# EAGLE design picoAvaR3 (EAGLE 6.1)
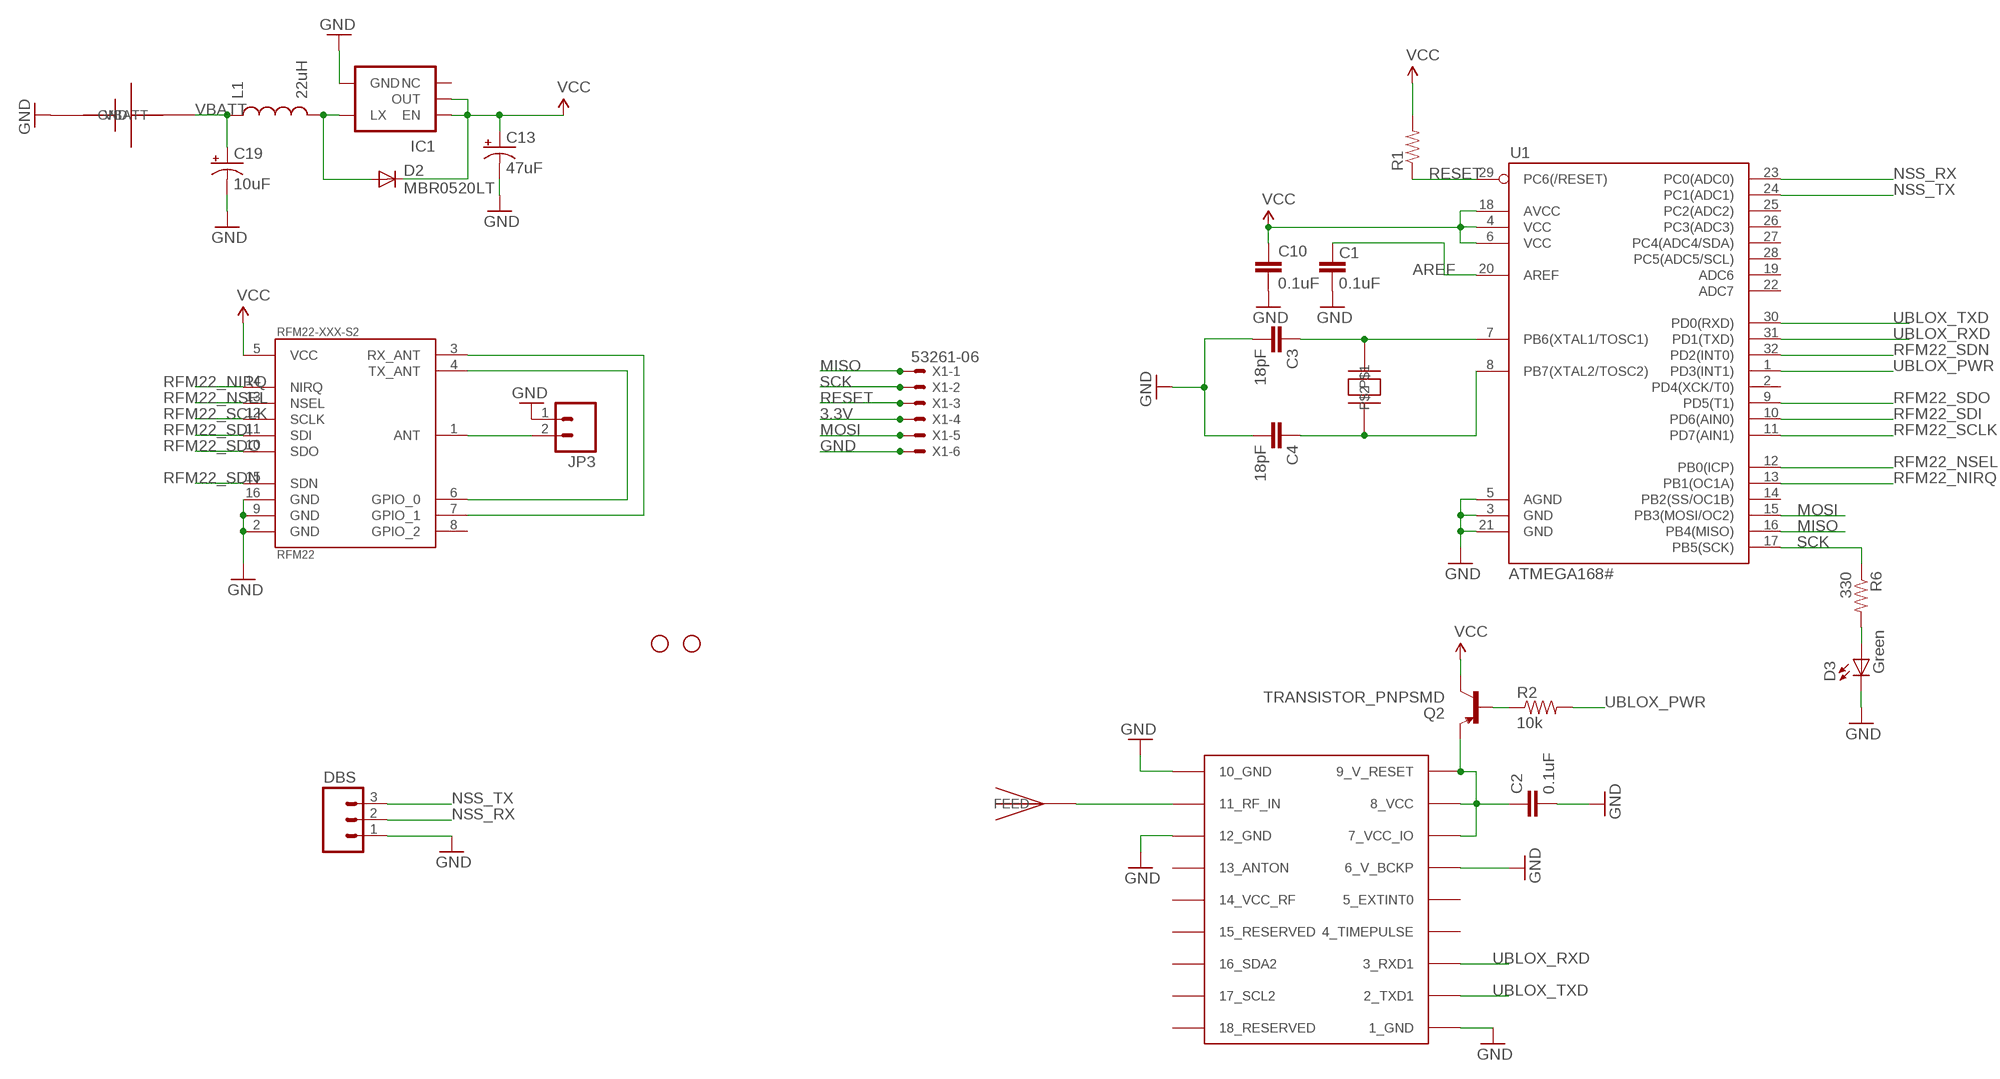
[diagram p0: schematic, sheet 1]

## Parts
C1  0.1uF  CAP0402-CAP  [0402-CAP]
C2  0.1uF  CAP0402-CAP  [0402-CAP]
C3  18pF  CAP0402-CAP  [0402-CAP]
C4  18pF  CAP0402-CAP  [0402-CAP]
C10  0.1uF  CAP0402-CAP  [0402-CAP]
C13  47uF  CAP_POL1206  [EIA3216]
C19  10uF  CAP_POL1206  [EIA3216]
D2  MBR0520LT  [SOD123]
D3  Green  LED0603  [LED-0603]
DBS  M03PTH  [1X03]
IC1  V_REG_NCP1400SOT23-5  [SOT23-5]
JP1  STAND-OFF  [STAND-OFF]
JP2  STAND-OFF  [STAND-OFF]
JP3  M02PTH  [1X02]
L1  22uH  INDUCTOR1210  [1210]
Q2  TRANSISTOR_PNPSMD  [SOT23-3]
R1  RESISTOR0402-RES  [0402-RES]
R2  10k  RESISTOR0402-RES  [0402-RES]
R6  330  RESISTOR0402-RES  [0402-RES]
RFM22-XXX-S2  RFM22  [RFM22-XXX-S2]
U1  ATMEGA168#  ATMEGA168  [TQFP32-08]
U$1  UBLOX_MAX-6  [UBLOX_MAX-6]
U$2  ABRACON_ABM3_CRYSTAL  [ABRACON_ABM3_CRYSTAL]
U$3  JTI_ANTENNA-1575AT43A40  [JTI_ANTENNA-1575AT43A40]
U$4  KEYSTONE-82-AAA-BATTERY-HOLDER  [KEYSTONE-82-AAA-BATTERY]
X1  53261-06  [53261-06]

## Nets
3.3V: C10.1 C13.A(+) D2.C IC1.1(EN) IC1.2(OUT) Q2.3(C) R1.2 RFM22-XXX-S2.5(VCC) U1.4(VCC) U1.6(VCC) U1.18(AVCC) X1.4 ; supply symbol labelled VCC
AREF: C1.2 U1.20(AREF)
GND [vcc]: C1.1 C2.2 C3.2 C4.2 C10.2 C13.C(-) C19.C(-) D3.C DBS.1 IC1.4(GND) JP3.1 RFM22-XXX-S2.2(GND) RFM22-XXX-S2.9(GND) RFM22-XXX-S2.16(GND) U1.3(GND) U1.5(AGND) U1.21(GND) U$1.1_GND U$1.6_V_BCKP U$1.10_GND U$1.12_GND U$4.GND U$4.GND2(GND) X1.6
MISO: U1.16(PB4(MISO)) X1.1
MOSI: U1.15(PB3(MOSI/OC2)) X1.5
N$3: JP3.2 RFM22-XXX-S2.1(ANT)
N$4: U$1.11_RF_IN U$3.FEED
N$5: RFM22-XXX-S2.3(RX_ANT) RFM22-XXX-S2.7(GPIO_1)
N$6: RFM22-XXX-S2.4(TX_ANT) RFM22-XXX-S2.6(GPIO_0)
N$7: D3.A R6.2
N$8: Q2.1(B) R2.1
N$9: C3.1 U1.7(PB6(XTAL1/TOSC1)) U$2.P$2
N$10: C4.1 U1.8(PB7(XTAL2/TOSC2)) U$2.P$1
N$11: D2.A IC1.5(LX) L1.2
NSS_RX: DBS.2 U1.23(PC0(ADC0))
NSS_TX: DBS.3 U1.24(PC1(ADC1))
RESET: R1.1 U1.29(PC6(/RESET)) X1.3
RFM22_NIRQ: RFM22-XXX-S2.14(NIRQ) U1.13(PB1(OC1A))
RFM22_NSEL: RFM22-XXX-S2.13(NSEL) U1.12(PB0(ICP))
RFM22_SCLK: RFM22-XXX-S2.12(SCLK) U1.11(PD7(AIN1))
RFM22_SDI: RFM22-XXX-S2.11(SDI) U1.10(PD6(AIN0))
RFM22_SDN: RFM22-XXX-S2.15(SDN) U1.32(PD2(INT0))
RFM22_SDO: RFM22-XXX-S2.10(SDO) U1.9(PD5(T1))
SCK: R6.1 U1.17(PB5(SCK)) X1.2
UBLOX_PWR: R2.2 U1.1(PD3(INT1))
UBLOX_RXD: U1.31(PD1(TXD)) U$1.3_RXD1
UBLOX_TXD: U1.30(PD0(RXD)) U$1.2_TXD1
VBATT [vcc]: C19.A(+) L1.1 U$4.VBATT U$4.VBATT1(VBATT)
VCC: C2.1 Q2.2(E) U$1.7_VCC_IO U$1.8_VCC U$1.9_V_RESET
Unconnected: IC1.3(NC) RFM22-XXX-S2.8(GPIO_2) U1.2(PD4(XCK/T0)) U1.14(PB2(SS/OC1B)) U1.19(ADC6) U1.22(ADC7) U1.25(PC2(ADC2)) U1.26(PC3(ADC3)) U1.27(PC4(ADC4/SDA)) U1.28(PC5(ADC5/SCL)) U$1.4_TIMEPULSE U$1.5_EXTINT0 U$1.13_ANTON U$1.14_VCC_RF U$1.15_RESERVED U$1.16_SDA2 U$1.17_SCL2 U$1.18_RESERVED

## Library data of the parts
C1-C4 C10 = SparkFun:CAP: Capacitor Standard 0603 ceramic capacitor, and 0.1" leaded capacitor.
C13 C19 = SparkFun:CAP_POL: Capacitor Polarized These are standard SMD and PTH capacitors. Normally 10uF, 47uF, and 100uF in electrolytic and tantalum varieties. Always verify the external diameter of the through hole cap, it varies with capacity, voltage, and manufacturer. The EIA devices should be standard.
D2 = diode:MBR0520LT: SCHOTTKY BARRIER RECTIFIER Source: http://onsemi.com .. MBR0520LT1-D.pdf
D3 = SparkFun:LED: LEDs Standard schematic elements and footprints for 5mm, 3mm, 1206, and 0603 sized LEDs. 5mm - Spark Fun Electronics SKU : COM-00529 (and others)
DBS = SparkFun:M03: Header 3 Standard 3-pin 0.1" header. Use with straight break away headers (SKU : PRT-00116), right angle break away headers (PRT-00553), swiss pins (PRT-00743), machine pins (PRT-00117), and female headers (PRT-00115). Molex polarized connector foot print use with SKU : PRT-08232 with associated crimp pins and housings.
IC1 = SparkFun:V_REG_NCP1400: Switching step-up voltage regulator NCP1400 switiching regulator takes single cell AA and outputs 100mA at 3.3V or 5V with minimal number of external components.
JP1 JP2 = SparkFun:STAND-OFF: Stand Off This is the mechanical footprint for a #4 phillips button head screw. Use the keepout ring to avoid running the screw head into surrounding components. SKU : PRT-00447
JP3 = SparkFun:M02: Header 2 Standard 2-pin 0.1" header. Use with straight break away headers (SKU : PRT-00116), right angle break away headers (PRT-00553), swiss pins (PRT-00743), machine pins (PRT-00117), and female headers (PRT-00115). Molex polarized connector foot print use with SKU : PRT-08233 with associated crimp pins and housings.
L1 = SparkFun:INDUCTOR: Inductors Basic Inductor/Choke - 0603 and 1206. Footprints are not proven and vary greatly between part numbers.
Q2 = SparkFun:TRANSISTOR_PNP
R1 R2 R6 = SparkFun:RESISTOR: Resistor Basic schematic elements and footprints for 0603, 1206, and PTH resistors.
RFM22-XXX-S2 = SparkFun:RFM22: *Hope RF's RFM22* Packages: RFM22-S2 (SMD)
U1 = SparkFun:ATMEGA168
U$1 = ava:UBLOX_MAX-6: UBLOX MAX-6
U$2 = ava:ABRACON_ABM3_CRYSTAL
U$3 = ava:JTI_ANTENNA-1575AT43A40
U$4 = ava:KEYSTONE-82-AAA-BATTERY-HOLDER
X1 = con-molex:53?-06: CONNECTOR wire to board 1.25 mm (.049 inch) pitch header; OC_FARNELL: 1125375; OC_NEWARK: unknown

## Net classes
0 default: width 0.203 mm
1 vcc: width 0.254 mm

## Board
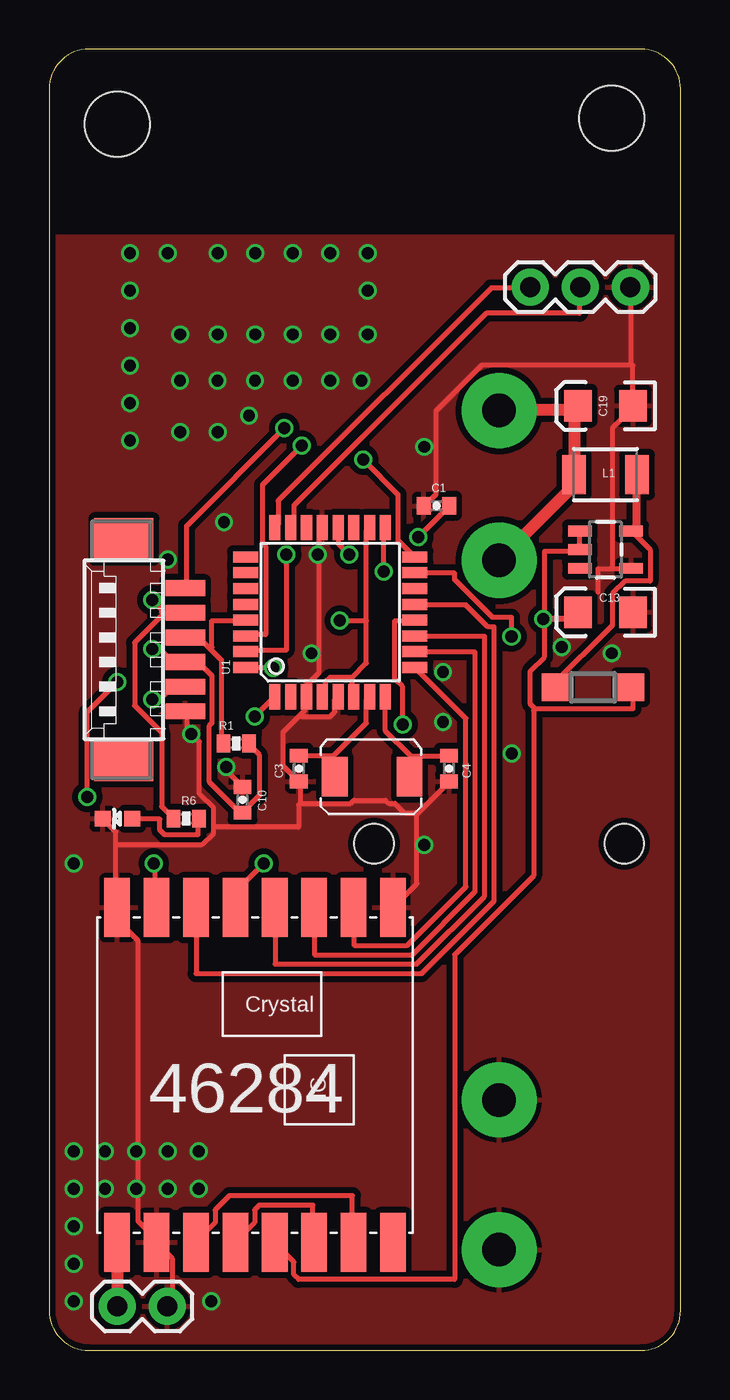
[diagram p1: board, top side]
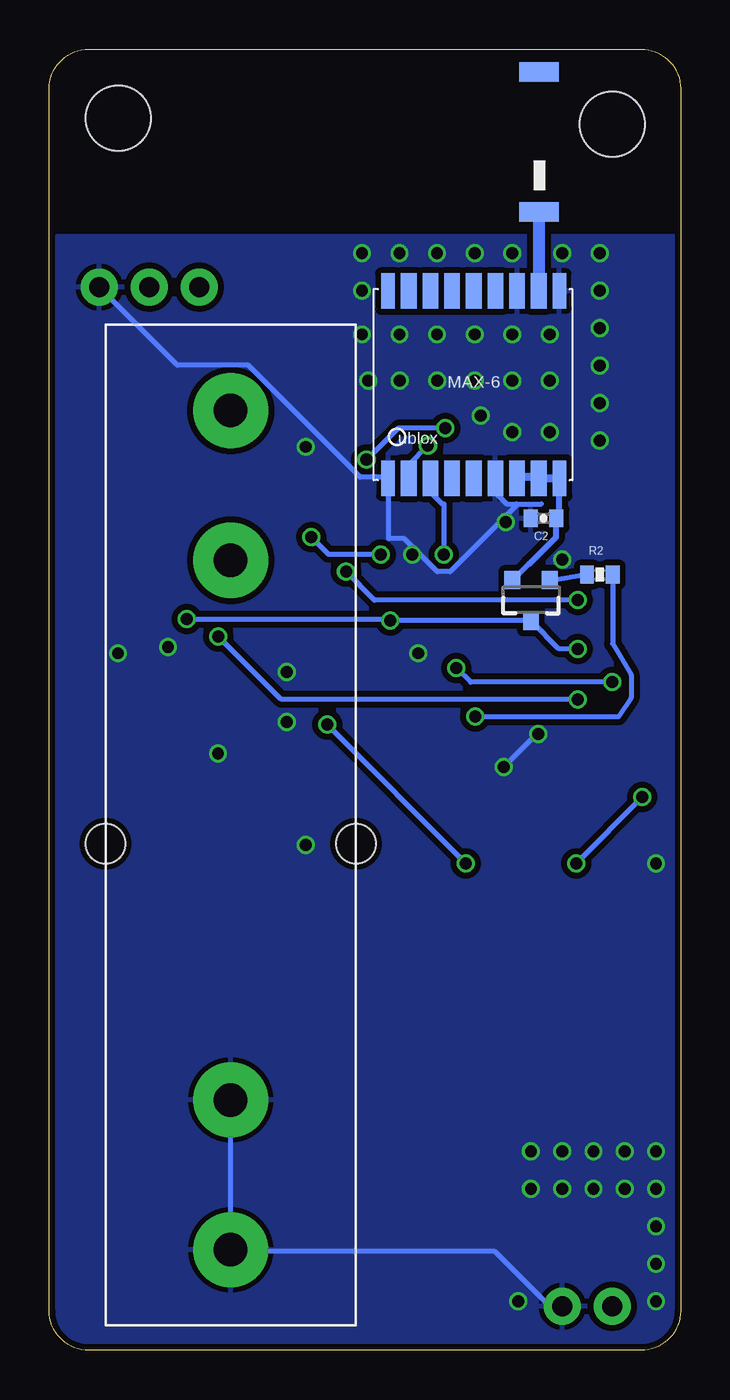
[diagram p2: board, bottom side, seen from below]

Size 32.03 x 66.04 mm. Coordinates in mm from the lower left corner, seen from the top.
Outline: 0,64.04 0,2 arc90 2,0 30.03,0 arc90 32.03,2 32.03,64.04 arc90 30.03,66.04 2,66.04 arc90 0,64.04
Copper layers (1*16): Top 0.035mm / dielectric 1.5mm / Bottom 0.035mm
Design rules: minimum track width 6mil, minimum drill 12mil, track to track 6mil, track to pad 6mil, pad to pad 6mil, via to via 6mil, smd to smd 0mil, copper to edge 10mil, drill to drill 10mil, minimum pad ring 10mil, minimum via ring 6mil, stop-mask expansion 2mil, vias tented up to drill 100mil, thermal gap 10mil
Holes 2 mm at 16.47,25.72 29.17,25.72

### Footprints (pad centres in the part's own frame; a part is rotated, then mirrored left to right if it is on the bottom)
0402-CAP = smd 0.7 x 0.9: 1 -0.65,0; 2 0.65,0
EIA3216 = smd 1.4 x 1.6: A 1.4,0; C -1.4,0
SOD123 = smd 1.4 x 1.4: A 1.9,0; C -1.9,0
LED-0603 = smd 0.8 x 0.8: A 0,-0.75; C 0,0.75
1X03 = drill 1.016 pad 1.88: 1 0,0; 2 2.54,0; 3 5.08,0
SOT23-5 = smd 0.55 x 1.2: 1 -0.95,-1.3; 2 0,-1.3; 3 0.95,-1.3; 4 0.95,1.3; 5 -0.95,1.3
STAND-OFF = hole 3.302: 0,0
1X02 = drill 1.016 pad 1.88: 1 0,0; 2 2.54,0
1210 = smd 1.2 x 2: 1 -1.6,0; 2 1.6,0
SOT23-3 = smd 0.8 x 0.9: 1 -0.95,-1; 2 0.95,-1; 3 0,1.1
0402-RES = smd 0.7 x 0.9: 1 -0.65,0; 2 0.65,0
RFM22-XXX-S2 = smd 3 x 1.3: 1 -8.5,7; 2 -8.5,5; 3 -8.5,3; 4 -8.5,1; 5 -8.5,-1; 6 -8.5,-3; 7 -8.5,-5; 8 -8.5,-7; 9 8.5,-7; 10 8.5,-5; 11 8.5,-3; 12 8.5,-1; 13 8.5,1; 14 8.5,3; 15 8.5,5; 16 8.5,7
TQFP32-08 = smd 1.27 x 0.559: 1 -4.293,2.8; 2 -4.293,2; 3 -4.293,1.2; 4 -4.293,0.4; 5 -4.293,-0.4; 6 -4.293,-1.2; 7 -4.293,-2; 8 -4.293,-2.8; 17 4.293,-2.8; 18 4.293,-2; 19 4.293,-1.2; 20 4.293,-0.4; 21 4.293,0.4; 22 4.293,1.2; 23 4.293,2; 24 4.293,2.8 | smd 0.559 x 1.27: 9 -2.8,-4.293; 10 -2,-4.293; 11 -1.2,-4.293; 12 -0.4,-4.293; 13 0.4,-4.293; 14 1.2,-4.293; 15 2,-4.293; 16 2.8,-4.293; 25 2.8,4.293; 26 2,4.293; 27 1.2,4.293; 28 0.4,4.293; 29 -0.4,4.293; 30 -1.2,4.293; 31 -2,4.293; 32 -2.8,4.293
UBLOX_MAX-6 = smd 1.8 x 0.7: 1_GND 4.95,-4.4; 9_V_RESET 4.95,4.3; 10_GND -4.55,4.3; 18_RESERVED -4.55,-4.4 | smd 1.8 x 0.8: 2_TXD1 4.95,-3.35; 3_RXD1 4.95,-2.25; 4_TIMEPULSE 4.95,-1.15; 5_EXTINT0 4.95,-0.05; 6_V_BCKP 4.95,1.05; 7_VCC_IO 4.95,2.15; 8_VCC 4.95,3.25; 11_RF_IN -4.55,3.25; 12_GND -4.55,2.15; 13_ANTON -4.55,1.05; 14_VCC_RF -4.55,-0.05; 15_RESERVED -4.55,-1.15; 16_SDA2 -4.55,-2.25; 17_SCL2 -4.55,-3.35
ABRACON_ABM3_CRYSTAL = smd 1.3 x 2: P$1 -3.4,0.1; P$2 0.4,0.1
JTI_ANTENNA-1575AT43A40 = smd 1 x 2: FEED -3.81,-1.27; NC 3.29,-1.27
KEYSTONE-82-AAA-BATTERY = drill 1.7 pad 3.81: GND -21.57,0; GND2 -13.97,0; VBATT 13.43,0; VBATT1 21.03,0
53261-06 = smd 0.8 x 2: 1 3.125,-2.5; 2 1.875,-2.5; 3 0.625,-2.5; 4 -0.625,-2.5; 5 -1.875,-2.5; 6 -3.125,-2.5 | smd 2.1 x 3: S1 5.625,0.625; S2 -5.625,0.625

### Placement (x,y rotation side)
C1  19.65,42.86 0 top
C2  6.95,42.23 180 bottom
C3  12.66,29.53 270 top
C4  20.28,29.53 270 top
C10  9.81,27.94 90 top
C13  28.22,37.47 180 top
C19  28.22,47.94 180 top
D2  27.59,33.66 180 top
D3  3.46,26.99 90 top
DBS  29.49,53.98 180 top
IC1  28.22,40.64 270 top
JP1  28.54,62.55 0 top
JP2  3.46,62.23 0 top
JP3  6,2.22 180 top
L1  28.22,44.45 0 top
Q2  7.58,38.1 180 bottom
R1  9.49,30.8 0 top
R2  4.09,39.37 0 bottom
R6  6.95,26.99 0 top
RFM22-XXX-S2  10.44,13.97 90 top
U1  14.25,37.47 90 top
U$1  10.44,49.21 270 bottom
U$2  14.89,29.21 180 top
U$3  8.46,61.59 90 bottom
U$4  22.82,26.67 90 bottom
X1  4.41,35.56 90 top

### Tracks (layer width: path | path; a pad name or v marks a point on that pad's centre or on a via)
3.3V  (via drill 0.61)
  Top 0.254: 15.37,34.16 14.25,34.16 14.01,33.92 14.01,33.36 13.85,33.2 U1.4 | 15.37,34.16 15.37,33.2 U1.6 | 16.09,37.04 16.09,34.88 15.37,34.16 | 16.09,37.04 16.09,41.6 16.17,41.68 U1.18 | R1.2 10.17,30.72 10.65,30.24 10.65,28.16 9.85,27.36 C10.1 9.69,27.28 8.09,28.88 8.09,31.68 8.25,31.84 8.25,34.24 7.61,34.88 6.97,34.88 X1.4 6.89,34.96 6.25,34.96 5.61,35.6 v5.21,35.6 | v14.73,37.04 16.09,37.04 | IC1.1 26.89,41.52 26.89,40.64 IC1.2 26.81,40.56 25.13,40.56 25.13,37.12 | 25.13,37.12 25.13,35.2 24.41,34.48 24.41,32.8 24.65,32.56 | 24.65,32.56 29.61,32.56 29.61,33.02 29.61,33.6 | RFM22-XXX-S2.5 11.45,5.44 12.41,4.48 12.41,3.84 12.65,3.6 20.57,3.6 20.57,20.08 24.57,24.08 24.57,32.48 24.65,32.56 | v25.05,37.12 25.13,37.12
  Top 0.305: 29.61,33.66 D2.C 29.49,33.68 29.69,33.68 | 29.81,33.66 29.61,33.66 | 29.61,33.66 29.61,33.02 | 25.05,37.15 v25.05,37.12 26.63,37.12 26.63,37.15 26.95,37.15 26.95,37.47 C13.A 26.63,37.47
  Bottom 0.254: v5.21,35.6 6.17,35.6 7.53,36.96 Q2.3 7.69,37.04 v14.73,37.04 14.81,37.12 v25.05,37.12
AREF  (via drill 0.61)
  Top 0.254: v18.73,41.28 20.25,42.8 C1.2 | v15.21,40.4 14.65,40.96 14.65,41.68 U1.20
  Bottom 0.254: v18.73,41.28 17.85,40.4 v15.21,40.4
GND  (via drill 0.6, 0.61)
  Top 0.254: JP3.1 6.25,1.92 6.25,4.64 5.45,5.44 RFM22-XXX-S2.2 5.45,5.6 4.49,6.56 4.49,20.8 3.53,21.76 3.53,22.4 RFM22-XXX-S2.16 3.37,22.48 3.37,25.68 | 28.57,39.68 27.85,39.68 27.85,38.48 | 28.57,39.68 29.45,39.68 IC1.4 | 29.53,50 29.61,50 29.61,48 C19.C 29.61,47.84 28.57,46.8 28.57,39.68 | 29.53,50 21.93,50 19.61,47.68 19.61,43.44 19.05,42.88 C1.1 | 29.53,50 29.53,53.92 DBS.1 | v8.97,29.6 8.97,29.44 9.77,28.64 C10.2 | X1.6 6.97,32.4 6.97,31.52 v7.21,31.28 7.61,30.88 7.61,28.24 8.33,27.52 8.33,26.56 | D3.C 3.37,26.32 3.37,25.68 | 8.33,26.56 8.33,26.24 7.77,25.68 3.37,25.68 | 18.65,27.2 20.25,28.8 C4.2 | 18.65,27.2 18.65,23.68 RFM22-XXX-S2.9 | 12.73,32.24 12.97,32.48 12.97,33.12 U1.3 13.05,33.28 13.05,33.76 13.69,34.4 13.69,40.4 | 12.73,32.24 11.85,31.36 11.85,29.68 C3.2 12.73,28.8 12.73,27.76 | U1.5 14.57,33.12 14.49,33.04 14.49,32.4 14.25,32.16 12.81,32.16 12.73,32.24 | 13.69,40.4 13.69,41.6 13.77,41.68 U1.21 | 12.73,27.76 15.29,27.76 15.45,27.92 17.05,27.92 17.21,27.76 17.53,27.76 18.01,27.28 18.57,27.28 18.65,27.2 | v13.61,40.4 13.69,40.4 | 8.33,26.56 12.65,26.56 12.65,27.68 12.73,27.76
  Bottom 0.254: JP3.1 6.33,1.92 9.45,5.04 22.81,5.04 U$4.GND 22.81,5.2 22.81,12.64 U$4.GND2 | v8.97,29.6 7.29,31.28 v7.21,31.28 | 8.33,42.96 8.81,42.96 9.37,43.52 9.37,44.24 U$1.6_V_BCKP | 8.33,42.96 7.05,42.96 | 13.37,40.56 12.33,39.52 11.69,39.52 8.33,42.88 8.33,42.96 | 13.37,40.56 14.01,41.2 14.81,41.2 14.81,44.24 U$1.1_GND 14.89,44.32 16.25,44.32 21.93,50 25.53,50 29.45,53.92 DBS.1 | v13.61,40.4 13.53,40.4 13.37,40.56
  other vias: 6.64,51.57 6.64,46.61 6.63,49.21 8.54,51.57 8.54,46.61 8.54,49.21 10.13,47.44 10.44,49.21 10.45,51.57 12.35,49.21 12.35,51.57 14.25,49.21 14.26,51.57 15.84,49.21 16.16,51.57 6,55.7 8.54,55.7 8.86,42.04 10.45,55.7 12.35,55.7 14.26,55.7 16.16,55.7 16.16,53.79 4.1,55.7 4.1,53.79 4.1,51.89 4.1,49.98 4.1,48.08 4.1,46.17 19.02,45.85 23.47,30.3 19.97,31.88 13.31,35.38 19.97,34.42 28.55,35.38 26.01,35.69 1.24,2.48 1.24,4.38 1.24,6.29 1.24,8.19 1.24,10.1 2.83,8.19 4.42,8.19 6,8.19 8.23,2.48 7.59,8.19 2.83,10.1 4.42,10.1 6,10.1 7.59,10.1 1.24,24.7 19.02,25.66 6,40.14
  pour Bottom (isolate 0.305): 0.13,56.53 31.64,56.53 31.96,0 0.13,0
  pour Top (isolate 0.305): 0.13,56.53 31.64,56.53 31.96,0 1.86,0 arc-90 -0.14,2.01
MISO  (via drill 0.61)
  Top 0.254: v15.93,45.2 17.69,43.44 17.69,41.12 18.49,40.32 U1.16 | v11.93,46.8 6.97,41.84 6.97,38.72 X1.1
  Bottom 0.254: v15.93,45.2 14.33,46.8 v11.93,46.8
MOSI  (via drill 0.61)
  Top 0.254: v23.45,36.24 23.45,37.2 22.49,37.2 20.57,39.12 20.57,39.44 18.57,39.44 U1.15 | v5.21,33.04 5.61,33.04 6.25,33.68 X1.5
  Bottom 0.254: v23.45,36.24 20.25,33.04 v5.21,33.04
N$3
  Top 0.254: 3.77,5.12 3.45,5.44 RFM22-XXX-S2.1
  Top 0.61: 3.77,5.12 3.46,5.12 JP3.2
N$4
  Bottom 0.61: U$3.FEED 7.19,56.83 U$1.11_RF_IN
N$5
  Top 0.254: RFM22-XXX-S2.3 7.45,5.52 8.41,6.48 8.41,7.12 9.13,7.84 15.37,7.84 15.37,5.52 RFM22-XXX-S2.7
N$6
  Top 0.254: RFM22-XXX-S2.4 9.45,5.52 10.41,6.48 10.41,7.12 10.65,7.36 13.37,7.36 13.37,5.52 RFM22-XXX-S2.6
N$7
  Top 0.254: D3.A 4.25,26.96 5.61,26.96 5.61,26.4 5.85,26.16 7.53,26.16 7.53,26.96 R6.2
N$8
  Bottom 0.254: R2.1 6.63,39.05 Q2.1
N$9
  Top 0.254: 14.41,30.16 12.73,30.16 C3.1 | 14.41,30.16 14.41,29.12 U$2.P$2 | 14.41,30.16 16.09,31.84 16.09,33.04 16.17,33.12 U1.7
N$10
  Top 0.254: 18.33,30.16 20.25,30.16 C4.1 | 18.33,30.16 18.33,29.12 U$2.P$1 | 18.33,30.16 17.05,31.44 17.05,33.12 U1.8
N$11
  Top 0.254: 29.77,41.84 IC1.5 29.61,41.52 30.49,40.64 30.49,39.04 29.21,39.04 28.57,38.4 28.57,36.8 25.45,33.68 | 29.77,44.4 L1.2
  Top 0.305: D2.A 25.45,33.66 25.45,33.68
  Top 0.406: 29.77,44.4 29.77,41.84
NSS_RX
  Top 0.254: U1.23 12.41,41.92 12.41,42.88 22.17,52.64 26.89,52.64 26.89,53.92 DBS.2
NSS_TX
  Top 0.254: U1.24 11.61,41.92 11.61,43.12 22.41,53.92 24.33,53.92 DBS.3
RESET
  Top 0.254: 8.17,35.6 7.61,36.16 6.97,36.16 X1.3 | 8.17,35.6 8.73,35.04 8.73,30.88 8.81,30.8 R1.1 | U1.29 9.93,37.04 8.25,37.04 8.25,35.68 8.17,35.6
RFM22_NIRQ
  Top 0.254: U1.13 18.57,37.84 21.13,37.84 22.25,36.72 22.57,36.72 22.57,22.8 18.89,19.12 7.45,19.12 7.45,22.4 RFM22-XXX-S2.14
RFM22_NSEL  (via drill 0.61)
  Top 0.254: v17.93,31.76 17.93,33.68 17.53,34.08 17.53,37.04 18.49,37.04 U1.12 | v10.89,24.72 9.45,23.28 RFM22-XXX-S2.13
  Bottom 0.254: v10.89,24.72 v17.93,31.76
RFM22_SCLK
  Top 0.254: U1.11 18.57,36.24 22.09,36.24 22.09,23.04 18.65,19.6 11.45,19.6 11.45,22.4 RFM22-XXX-S2.12
RFM22_SDI
  Top 0.254: U1.10 18.57,35.44 21.61,35.44 21.61,23.28 18.41,20.08 13.45,20.08 13.45,22.4 RFM22-XXX-S2.11
RFM22_SDN  (via drill 0.61)
  Top 0.254: v11.37,34.64 10.01,34.64 U1.32 | v3.45,33.92 1.93,32.4 v1.93,28.08 | v5.29,24.72 5.37,24.64 5.37,22.48 RFM22-XXX-S2.15
  Bottom 0.254: v11.37,34.64 10.65,33.92 v3.45,33.92 | v5.29,24.72 v1.93,28.08
RFM22_SDO
  Top 0.254: U1.9 18.57,34.64 21.13,32.08 21.13,23.52 18.17,20.56 15.45,20.56 15.45,22.4 RFM22-XXX-S2.10
SCK  (via drill 0.61)
  Top 0.254: 5.77,37.36 4.33,35.92 4.33,32.72 5.69,31.36 5.69,27.6 6.25,27.04 R6.1 | 5.77,37.36 6.89,37.36 X1.2 | v16.97,39.52 16.97,41.68 U1.17 | v5.21,38.08 5.69,37.6 5.69,37.44 5.77,37.36
  Bottom 0.254: v16.97,39.52 15.53,38.08 v5.21,38.08
UBLOX_PWR  (via drill 0.61)
  Top 0.254: v10.41,32.16 11.37,33.12 U1.1
  Bottom 0.254: v10.41,32.16 3.14,32.16 2.5,33.11 2.5,34.29 3.44,35.86 R2.2
UBLOX_RXD  (via drill 0.61)
  Top 0.254: v12.01,40.4 12.01,35.52 10.01,35.52 U1.31
  Bottom 0.254: v12.01,40.4 12.01,42.96 12.09,42.96 12.65,43.52 12.65,44.24 U$1.3_RXD1
UBLOX_TXD  (via drill 0.61)
  Top 0.254: v12.81,45.92 10.81,43.92 10.81,40.96 10.97,40.8 10.97,36.32 10.01,36.32 U1.30
  Bottom 0.254: v12.81,45.92 13.77,44.96 13.77,44.32 U$1.2_TXD1
VBATT
  Top 0.254: 26.65,47.76 26.81,47.92 C19.A 26.57,47.76 | 26.65,44.48 L1.1 26.57,44.4 26.57,43.84 | 22.89,47.76 U$4.VBATT1 | 22.89,40.16 U$4.VBATT
  Top 0.61: 26.65,44.48 26.65,47.76 | 22.89,47.76 26.57,47.76 | 26.57,43.84 22.89,40.16
VCC
  Bottom 0.254: 6.97,44.24 7.13,44.24 U$1.8_VCC 7.29,44.32 | 7.69,39.92 8.49,39.12 Q2.2 | 6.17,44.24 U$1.9_V_RESET | 8.25,44.32 U$1.7_VCC_IO
  Bottom 0.305: 7.69,39.92 7.67,39.92 6.31,41.27 6.31,41.91 C2.1 6.17,42.03 6.17,44.24 | 6.84,44.24 6.95,44.13 7.06,44.13 U$1.8_VCC
  Bottom 0.406: 7.29,44.32 8.25,44.32 | 6.17,44.24 6.84,44.24

### Text on the board
tPlace: 46284
tStop: picoTracker V1 | 2E0UPU
bStop: + | -